# EAGLE schematic amberjackBeo (EAGLE 9.5.2)
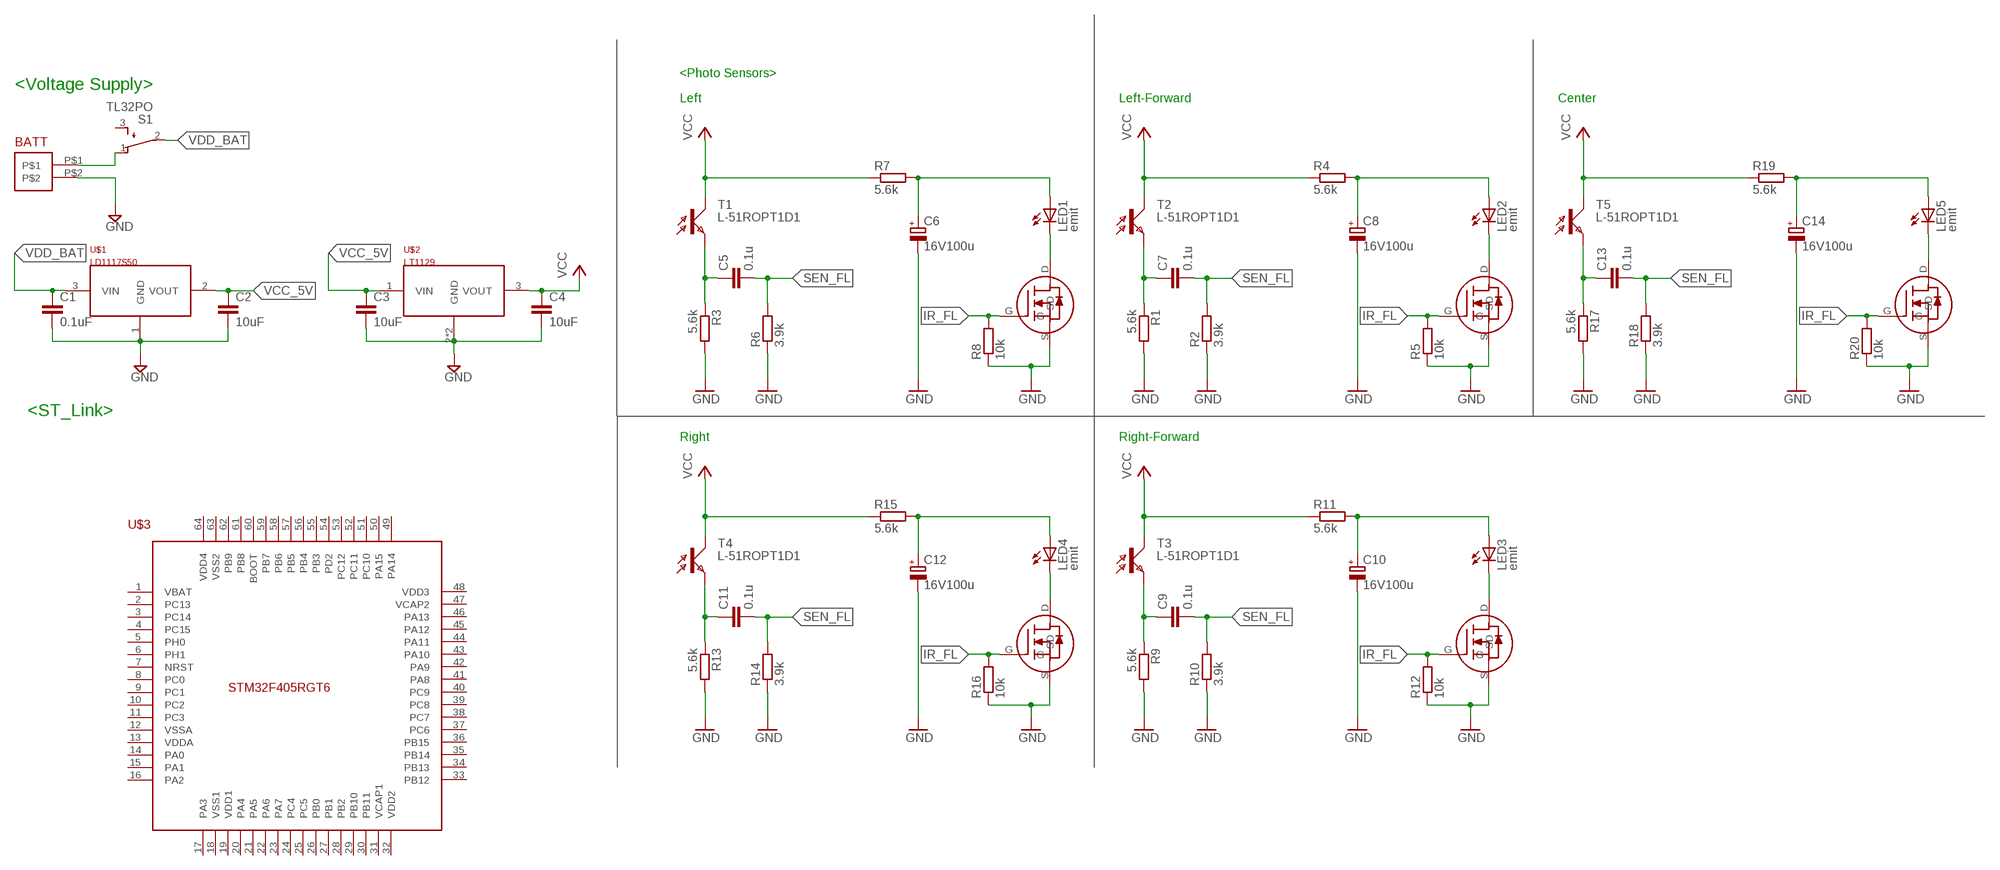
[diagram p0: schematic, sheet 1]

## Parts
2N1  2N7000  [2N7000]
2N2  2N7000  [2N7000]
2N3  2N7000  [2N7000]
2N4  2N7000  [2N7000]
2N5  2N7000  [2N7000]
BATT  XA_2P  [XA_2P]
C1  0.1uF  C-EUC0603  [C0603]
C2  10uF  C-EUC0603  [C0603]
C3  10uF  C-EUC0603  [C0603]
C4  10uF  C-EUC0603  [C0603]
C5  0.1u  C-EUC0805  [C0805]
C6  16V100u  CPOL-EU153CLV-0807  [153CLV-0807]
C7  0.1u  C-EUC0805  [C0805]
C8  16V100u  CPOL-EU153CLV-0807  [153CLV-0807]
C9  0.1u  C-EUC0805  [C0805]
C10  16V100u  CPOL-EU153CLV-0807  [153CLV-0807]
C11  0.1u  C-EUC0805  [C0805]
C12  16V100u  CPOL-EU153CLV-0807  [153CLV-0807]
C13  0.1u  C-EUC0805  [C0805]
C14  16V100u  CPOL-EU153CLV-0807  [153CLV-0807]
LED1  emit  LED5MM  [LED5MM]
LED2  emit  LED5MM  [LED5MM]
LED3  emit  LED5MM  [LED5MM]
LED4  emit  LED5MM  [LED5MM]
LED5  emit  LED5MM  [LED5MM]
R1  5.6k  R-EU_M0805  [M0805]
R2  3.9k  R-EU_M0805  [M0805]
R3  5.6k  R-EU_M0805  [M0805]
R4  5.6k  R-EU_M0805  [M0805]
R5  10k  R-EU_M0805  [M0805]
R6  3.9k  R-EU_M0805  [M0805]
R7  5.6k  R-EU_M0805  [M0805]
R8  10k  R-EU_M0805  [M0805]
R9  5.6k  R-EU_M0805  [M0805]
R10  3.9k  R-EU_M0805  [M0805]
R11  5.6k  R-EU_M0805  [M0805]
R12  10k  R-EU_M0805  [M0805]
R13  5.6k  R-EU_M0805  [M0805]
R14  3.9k  R-EU_M0805  [M0805]
R15  5.6k  R-EU_M0805  [M0805]
R16  10k  R-EU_M0805  [M0805]
R17  5.6k  R-EU_M0805  [M0805]
R18  3.9k  R-EU_M0805  [M0805]
R19  5.6k  R-EU_M0805  [M0805]
R20  10k  R-EU_M0805  [M0805]
S1  TL32PO  [TL3XPO]
T1  L-51ROPT1D1  [L-51ROPT1D1]
T2  L-51ROPT1D1  [L-51ROPT1D1]
T3  L-51ROPT1D1  [L-51ROPT1D1]
T4  L-51ROPT1D1  [L-51ROPT1D1]
T5  L-51ROPT1D1  [L-51ROPT1D1]
U$1  LD1117S50  [SOT223]
U$2  LT1129  [SOT223]
U$3  STM32F405RGT6  [LQFP-ST-64-2]

## Nets
GND: 2N1.S 2N2.S 2N3.S 2N4.S 2N5.S BATT.P$2 C1.2 C2.2 C6.- C8.- C10.- C12.- C14.- R1.2 R2.1 R3.2 R5.1 R6.1 R8.1 R9.2 R10.1 R12.1 R13.2 R14.1 R16.1 R17.2 R18.1 R20.1 U$1.1(GND)
IR_FL: 2N1.G 2N2.G 2N3.G 2N4.G 2N5.G R5.2 R8.2 R12.2 R16.2 R20.2
N$1: BATT.P$1 S1.1(O)
N$2: C5.1 R3.1 T1.EMITTER(E)
N$3: C6.+ LED1.A R7.2
N$4: C3.2 C4.2 U$2.2(GND) U$2.4(GND) ; supply symbol labelled GND
N$5: 2N2.D LED1.K(C)
N$6: C7.1 R1.1 T2.EMITTER(E)
N$7: C8.+ LED2.A R4.2
N$8: 2N1.D LED2.K(C)
N$9: C9.1 R9.1 T3.EMITTER(E)
N$10: C10.+ LED3.A R11.2
N$11: 2N3.D LED3.K(C)
N$12: C11.1 R13.1 T4.EMITTER(E)
N$13: C12.+ LED4.A R15.2
N$14: 2N4.D LED4.K(C)
N$15: C13.1 R17.1 T5.EMITTER(E)
N$16: C14.+ LED5.A R19.2
N$17: 2N5.D LED5.K(C)
SEN_FL: C5.2 C7.2 C9.2 C11.2 C13.2 R2.2 R6.2 R10.2 R14.2 R18.2
VCC: C4.1 R4.1 R7.1 R11.1 R15.1 R19.1 T1.COLLECTOR(C) T2.COLLECTOR(C) T3.COLLECTOR(C) T4.COLLECTOR(C) T5.COLLECTOR(C) U$2.3(VOUT)
VCC_5V: C2.1 C3.1 U$1.2(VOUT) U$2.1(VIN)
VDD_BAT: C1.1 S1.2(P) U$1.3(VIN)
Unconnected: S1.3(S) U$3.1(VBAT) U$3.2(PC13) U$3.3(PC14) U$3.4(PC15) U$3.5(PH0) U$3.6(PH1) U$3.7(NRST) U$3.8(PC0) U$3.9(PC1) U$3.10(PC2) U$3.11(PC3) U$3.12(VSSA) U$3.13(VDDA) U$3.14(PA0) U$3.15(PA1) U$3.16(PA2) U$3.17(PA3) U$3.18(VSS1) U$3.19(VDD1) U$3.20(PA4) U$3.21(PA5) U$3.22(PA6) U$3.23(PA7) U$3.24(PC4) U$3.25(PC5) U$3.26(PB0) U$3.27(PB1) U$3.28(PB2) U$3.29(PB10) U$3.30(PB11) U$3.31(VCAP1) U$3.32(VDD2) U$3.33(PB12) U$3.34(PB13) U$3.35(PB14) U$3.36(PB15) U$3.37(PC6) U$3.38(PC7) U$3.39(PC8) U$3.40(PC9) U$3.41(PA8) U$3.42(PA9) U$3.43(PA10) U$3.44(PA11) U$3.45(PA12) U$3.46(PA13) U$3.47(VCAP2) U$3.48(VDD3) U$3.49(PA14) U$3.50(PA15) U$3.51(PC10) U$3.52(PC11) U$3.53(PC12) U$3.54(PD2) U$3.55(PB3) U$3.56(PB4) U$3.57(PB5) U$3.58(PB6) U$3.59(PB7) U$3.60(BOOT) U$3.61(PB8) U$3.62(PB9) U$3.63(VSS2) U$3.64(VDD4)

## Notes on the sheet
- <Photo Sensors>
- <Voltage Supply>
- Left | Left-Forward | Center
- <ST_Link>
- Right | Right-Forward

## Library data of the parts
2N1-2N5 = 2n7000:2N7000
BATT = amberjackCeoParts:XA_2P
C1-C5 C7 C9 C11 C13 = rcl:C-EU: CAPACITOR, European symbol; SPICEPREFIX: C
C6 C8 C10 C12 C14 = rcl:CPOL-EU: POLARIZED CAPACITOR, European symbol; SPICEPREFIX: C
LED1-LED5 = MicroMouseYR:LED: LEDs Standard schematic elements and footprints for 5mm, 3mm, 1206, and 0603 sized LEDs. 5mm - Spark Fun Electronics SKU : COM-00529 (and others)
R1-R20 = MicroMouseYR:R-EU_: RESISTOR, European symbol
S1 = switch:TL32PO: TINY SWITCH ON - MOM Source: http://www2.produktinfo.conrad.com/datenblaetter/700000-724999/705152-da-01-de-Subminiaturschalter_TL_36YO.pdf
T1-T5 = lightsensor:L-51ROPT1D1
U$1 = amberjackCeoParts:LD1117S50
U$2 = amberjackCeoParts:LT1129
U$3 = amberjackCeoParts:STM32F405RGT6